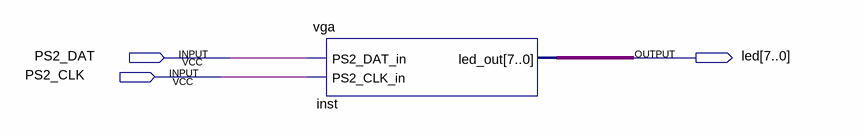
[diagram p0: schematic sheet]
// Quartus schematic project_1.bdf as structural Verilog: 1 symbols, 3 pins
module project_1 (
  input  PS2_DAT,
  input  PS2_CLK,
  output [7:0] led
);

  vga inst (.PS2_DAT_in(PS2_DAT), .PS2_CLK_in(PS2_CLK), .led_out(led));
endmodule
